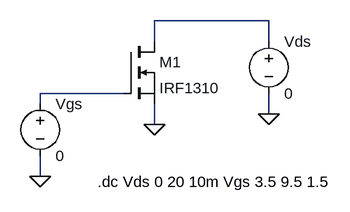
[diagram p0: schematic mosfet.asc]
mosfet.asc, the LTspice schematic file:
Version 4
SHEET 1 880 680
WIRE 384 64 208 64
WIRE 208 96 208 64
WIRE 384 96 384 64
WIRE 160 176 32 176
WIRE 32 192 32 176
WIRE 384 208 384 176
WIRE 208 224 208 192
WIRE 32 304 32 272
FLAG 32 304 0
FLAG 208 224 0
FLAG 384 208 0
SYMBOL voltage 32 176 R0
WINDOW 123 0 0 Left 0
WINDOW 39 0 0 Left 0
SYMATTR InstName Vgs
SYMATTR Value 0
SYMBOL voltage 384 80 R0
WINDOW 123 0 0 Left 0
WINDOW 39 0 0 Left 0
SYMATTR InstName Vds
SYMATTR Value 0
SYMBOL nmos 160 96 R0
SYMATTR InstName M1
SYMATTR Value IRF1310
TEXT 120 312 Left 2 !.dc Vds 0 20 10m Vgs 3.5 9.5 1.5

The netlist it stands for:
* mosfet.asc
Vgs N002 0 0
Vds N001 0 0
M1 N001 N002 0 0 IRF1310
.model NMOS NMOS
.model PMOS PMOS
.lib standard.mos
.dc Vds 0 20 10m Vgs 3.5 9.5 1.5
.backanno
.end